# Altium schematic sheet 02_Power.SchDoc: =ProjectTitle
size A3; Organization: Nerdtronix GmbH; Address1: Industriestraße 14a; Address2: D-86438 Kissing; SheetNumber: 2; SheetTotal: 3
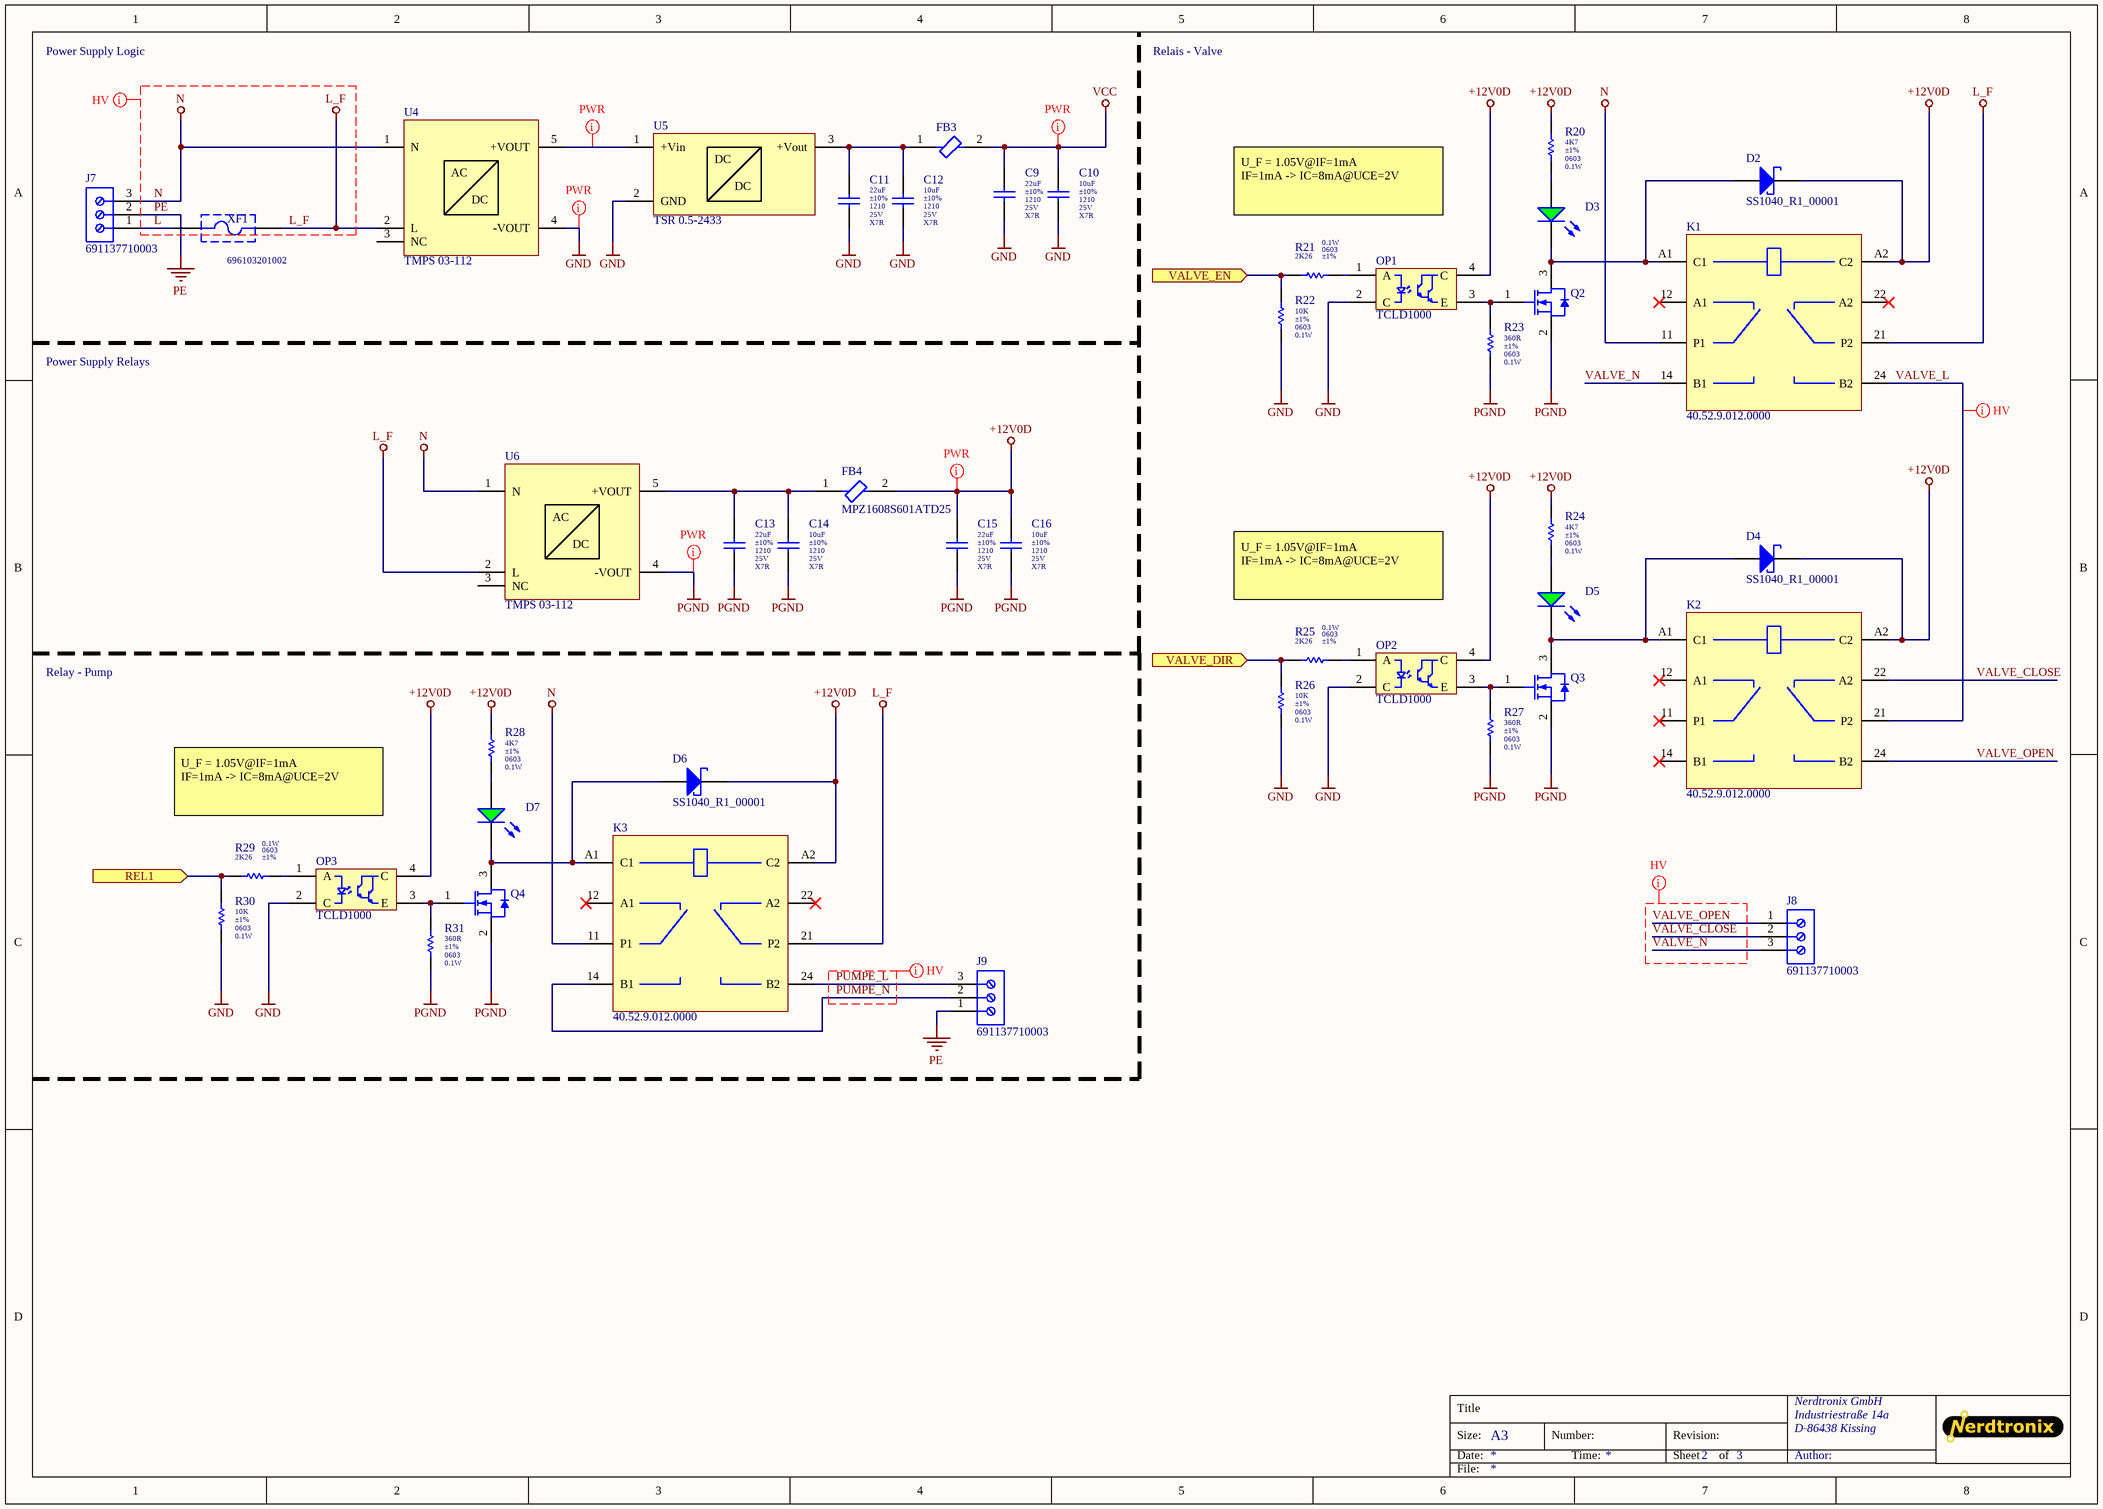
[diagram p0: 02_Power.SchDoc]

## Parts
C9  value 22uF  Tolerance: ±10%  Package: 1210  Voltage: 25V  Dielectric: X7R  [C_1210_B]  (hidden comment: CL32B226KAJNNNE)
C10  value 10uF  Tolerance: ±10%  Package: 1210  Voltage: 25V  Dielectric: X7R  [C_1210_B]  (hidden comment: CL32B106KAJNNNE)
C11  value 22uF  Tolerance: ±10%  Package: 1210  Voltage: 25V  Dielectric: X7R  [C_1210_B]  (hidden comment: CL32B226KAJNNNE)
C12  value 10uF  Tolerance: ±10%  Package: 1210  Voltage: 25V  Dielectric: X7R  [C_1210_B]  (hidden comment: CL32B106KAJNNNE)
C13  value 22uF  Tolerance: ±10%  Package: 1210  Voltage: 25V  Dielectric: X7R  [C_1210_B]  (hidden comment: CL32B226KAJNNNE)
C14  value 10uF  Tolerance: ±10%  Package: 1210  Voltage: 25V  Dielectric: X7R  [C_1210_B]  (hidden comment: CL32B106KAJNNNE)
C15  value 22uF  Tolerance: ±10%  Package: 1210  Voltage: 25V  Dielectric: X7R  [C_1210_B]  (hidden comment: CL32B226KAJNNNE)
C16  value 10uF  Tolerance: ±10%  Package: 1210  Voltage: 25V  Dielectric: X7R  [C_1210_B]  (hidden comment: CL32B106KAJNNNE)
D2  SS1040_R1_00001  [SS1040_R1_00001]
D3  SML-D12P8WT86  [0603 LED]  (value not drawn)
D4  SS1040_R1_00001  [SS1040_R1_00001]
D5  SML-D12P8WT86  [0603 LED]  (value not drawn)
D6  SS1040_R1_00001  [SS1040_R1_00001]
D7  SML-D12P8WT86  [0603 LED]  (value not drawn)
FB3  MPZ1608S601ATD25  [MPZ1608S601ATD25]  (value not drawn)
FB4  MPZ1608S601ATD25  [MPZ1608S601ATD25]
J7  691137710003  [691137710003]
J8  691137710003  [691137710003]
J9  691137710003  [691137710003]
K1  40.52.9.012.0000  [40.52.9.012.0000]
K2  40.52.9.012.0000  [40.52.9.012.0000]
K3  40.52.9.012.0000  [40.52.9.012.0000]
OP1  TCLD1000  [TCLD1000]
OP2  TCLD1000  [TCLD1000]
OP3  TCLD1000  [TCLD1000]
Q2  IRLML6244TRPBF  [IRLML6244TRPBF]  (value not drawn)
Q3  IRLML6244TRPBF  [IRLML6244TRPBF]  (value not drawn)
Q4  IRLML6244TRPBF  [IRLML6244TRPBF]  (value not drawn)
R20  value 4K7  Package: 0603  Power: 0.1W  Tolerance: ±1%  [R_0603_B]  (hidden comment: RC0603FR-074K7L)
R21  value 2K26  Package: 0603  Power: 0.1W  Tolerance: ±1%  [R_0603_B]  (hidden comment: RC0603FR-072K26L)
R22  value 10K  Package: 0603  Power: 0.1W  Tolerance: ±1%  [R_0603_B]  (hidden comment: RC0603FR-0710KL)
R23  value 360R  Package: 0603  Power: 0.1W  Tolerance: ±1%  [R_0603_B]  (hidden comment: RC0603FR-07360RL)
R24  value 4K7  Package: 0603  Power: 0.1W  Tolerance: ±1%  [R_0603_B]  (hidden comment: RC0603FR-074K7L)
R25  value 2K26  Package: 0603  Power: 0.1W  Tolerance: ±1%  [R_0603_B]  (hidden comment: RC0603FR-072K26L)
R26  value 10K  Package: 0603  Power: 0.1W  Tolerance: ±1%  [R_0603_B]  (hidden comment: RC0603FR-0710KL)
R27  value 360R  Package: 0603  Power: 0.1W  Tolerance: ±1%  [R_0603_B]  (hidden comment: RC0603FR-07360RL)
R28  value 4K7  Package: 0603  Power: 0.1W  Tolerance: ±1%  [R_0603_B]  (hidden comment: RC0603FR-074K7L)
R29  value 2K26  Package: 0603  Power: 0.1W  Tolerance: ±1%  [R_0603_B]  (hidden comment: RC0603FR-072K26L)
R30  value 10K  Package: 0603  Power: 0.1W  Tolerance: ±1%  [R_0603_B]  (hidden comment: RC0603FR-0710KL)
R31  value 360R  Package: 0603  Power: 0.1W  Tolerance: ±1%  [R_0603_B]  (hidden comment: RC0603FR-07360RL)
U4  TMPS 03-112  [TMPS 03]
U5  TSR 0.5-2433  [TSR 0.5-2433-Footprint-1]
U6  TMPS 03-112  [TMPS 03]
XF1  696103201002  [696103201002]

## Ports
REL1 (in), VALVE_DIR (in), VALVE_EN (in)

## Nets
+12V0D: C15.2 C16.2 D2.K D4.K D6.K FB4.2 K1.A2(C2) K2.A2(C2) K3.A2(C2) OP1.4(C) OP2.4(C) OP3.4(C) R20.2 R24.2 R28.2
GND: C9.1 C10.1 C11.1 C12.1 OP1.2(C) OP2.2(C) OP3.2(C) R22.1 R26.1 R30.1 U4.4(-VOUT) U5.2(GND)
L_F: K1.21(P2) K3.21(P2) U4.2(L) U6.2(L) XF1.2
N: J7.3 K1.11(P1) K3.11(P1) U4.1(N) U6.1(N)
PE: J7.2 J9.1
PGND: C13.1 C14.1 C15.1 C16.1 Q2.2(S) Q3.2(S) Q4.2(S) R23.1 R27.1 R31.1 U6.4(-VOUT)
VCC: C9.2 C10.2 FB3.2
L: J7.1 XF1.1
PUMPE_L: J9.3 K3.24(B2)
PUMPE_N: J9.2 K3.14(B1)
REL1: R29.2 R30.2 ; port REL1
VALVE_CLOSE: J8.2 K2.22(A2)
VALVE_DIR: R25.2 R26.2 ; port VALVE_DIR
VALVE_EN: R21.2 R22.2 ; port VALVE_EN
VALVE_L: K1.24(B2) K2.21(P2)
VALVE_N: J8.3 K1.14(B1)
VALVE_OPEN: J8.1 K2.24(B2)
NetC11_2: C11.2 C12.2 FB3.1 U5.3(+Vout)
NetC13_2: C13.2 C14.2 FB4.1 U6.5(+VOUT)
NetD2_A: D2.A D3.K K1.A1(C1) Q2.3(D)
NetD3_A: D3.A R20.1
NetD4_A: D4.A D5.K K2.A1(C1) Q3.3(D)
NetD5_A: D5.A R24.1
NetD6_A: D6.A D7.K K3.A1(C1) Q4.3(D)
NetD7_A: D7.A R28.1
NetOP1_1: OP1.1(A) R21.1
NetOP1_3: OP1.3(E) Q2.1(G) R23.2
NetOP2_1: OP2.1(A) R25.1
NetOP2_3: OP2.3(E) Q3.1(G) R27.2
NetOP3_1: OP3.1(A) R29.1
NetOP3_3: OP3.3(E) Q4.1(G) R31.2
NetU4_5: U4.5(+VOUT) U5.1(+Vin)

Not connected (* = marked no-connect by the designer): K1 12(A1)* 22(A2)*; K2 11(P1)* 12(A1)* 14(B1)*; K3 12(A1)* 22(A2)*; U4 3(NC); U6 3(NC)

## Layout directives
net class HV: L, L_F, N, PE, PUMPE_L, PUMPE_N, VALVE_CLOSE, VALVE_L, VALVE_N, VALVE_OPEN
net class PWR: +12V0D, GND, NetU4_5, PGND, VCC

## Notes on the sheet
- Power Supply Logic
- Relais - Valve
- U_F = 1.05V@IF=1mA
  IF=1mA -> IC=8mA@UCE=2V
- Power Supply Relays
- Relay - Pump
- Title
- Size:
- Date:
- A3
- Number:
- Time:
- Revision:
- Sheet
- of
- Author:
- File:
- (in symbol CMP-002-000000-10) AC; DC
- (in symbol CMP-002-000808-6) DC

## Library data of the parts
C9 C11 C13 C15 = CMP-002-001930-51: CAP 22uF 25V 1210 ±10% X7R; Manufacturer: Samsung; Pad Count: 2; Maximum Operating Temperature: 125; Packaging: cut tape; Distributor: Digikey; Minimum Operating Temperature: -55; Distributor Ordering Code: 1276-3392-1-ND; Creator: MSt 31-08-21; RoHS: Yes; Manufacturer Part Number: CL32B226KAJNNNE; Mounting Type: SMT
C10 C12 C14 C16 = CMP-002-001929-51: CAP 10uF 25V 1210 ±10% X7R; Manufacturer: Samsung; Pad Count: 2; Creator: MSt 31-08-21; Mounting Type: SMT; Manufacturer Part Number: CL32B106KAJNNNE; Maximum Operating Temperature: 125; Distributor Ordering Code: 1276-1807-1-ND; RoHS: Yes; Packaging: cut tape; Distributor: Digikey; Minimum Operating Temperature: -55
D2 D4 D6 = CMP-004-00002-7: Schottky Diode, 0.55V UF@IF=1A, 1A IF_max, SOD-123; Manufacturer: Panjit International; Pad Count: 2; UF: 0.55V; Packaging: Cut Tape; RoHS: yes; Mounting Type: SMT; Distributor: Digikey; Distributor Ordering Code: 3757-SS1040_R1_00001CT-ND; Manufacturer Part Number: SS1040_R1_00001; Design Item ID: SS1040_R1_00001; Maximum Operating Temperature: 125; Minimum Operating Temperature: -55; Creator: MSt 06-02-22; IF: 1A
D3 D5 D7 = CMP-004-00001-11: Green LED 0603; Manufacturer: Rohm Semiconductor; Pad Count: 2; Mounting Type: SMT; Maximum Operating Temperature: 85; Distributor Ordering Code: 511-1579-1-ND; Minimum Operating Temperature: -40; RoHS: Yes; Packaging: Cut Tape; Manufacturer Part Number: SML-D12P8WT86; Creator: MSt 31-01-22; Distributor: Digikey
FB3 FB4 = CMP-00011-4: SMD Ferrit Bead 600Ω@100MHz 1A DCR 150mΩ; Manufacturer: TDK; Z@100MHz: 600Ω; Pad Count: 2; Distributor: Digikey; Mounting Type: SMT; RoHS: Yes; Minimum Operating Temperature: -55; Design Item ID: MPZ1608S601ATD25; Distributor Ordering Code: 445-MPZ1608S601ATD25CT-ND; Packaging: Cut Tape; Maximum Operating Temperature: 125; Manufacturer Part Number: MPZ1608S601ATD25; Creator: MSt 03-08-23
J7-J9 = CMP-003-000003-7: WR-TBL Serie 1377 Horizontal Entry, Pressure Clamp, THT, Pitch 5mm, 3p; Manufacturer: Wuerth Elektronik; Pad Count: 3; Mounting Type: THT; Packaging: Bag; Minimum Operating Temperature: -30; Creator: MSt 08-12-21; Distributor Ordering Code: 732-10956-ND; Distributor: Digikey; Manufacturer Part Number: 691137710003; RoHS: Yes; Maximum Operating Temperature: 110
K1-K3 = CMP-002-000814-7: Relay Double Pole, 12V Coil Voltage, 8.0 A Continous Switched Current; Manufacturer: Finder Relays; coil_resistance: 220Ohm; coil_voltage_min: 8.8V; coil_voltage_max: 18.0V; Pad Count: 8; coil_current: 55mA; Distributor Ordering Code: 2066-40.52.9.012.0000-ND; Distributor: Digikey; Mounting Type: THT; Maximum Operating Temperature: 85; Minimum Operating Temperature: -40; Packaging: Bag; Manufacturer Part Number: 40.52.9.012.0000; RoHS: Yes; Creator: MSt 08-12-21
OP1-OP3 = CMP-006-000012-4: Optocoupler, Photodarlington Output; Manufacturer: Vishay; Pad Count: 4; Distributor: Digikey; Mounting Type: SMT; RoHS: Yes; Design Item ID: TCLD1000; Creator: MSt 23-08-22; Manufacturer Part Number: TCLD1000; Distributor Ordering Code: TCLD1000CT-ND; Packaging: Cut Tape; Minimum Operating Temperature: -55; Maximum Operating Temperature: 100
Q2-Q4 = CMP-013-00002-6: N-MOSFET Vds 20V Uth 1.1V ID 5.1A RDSon 27mΩ; Manufacturer: Infineon Technologies; Pad Count: 3; Distributor: Digikey; Distributor Ordering Code: IRLML6244TRPBFCT-ND; Manufacturer Part Number: IRLML6244TRPBF; Mounting Type: SMT; RoHS: Yes; Creator: MSt 10-10-22; Maximum Operating Temperature: 150; Packaging: Cut Tape; Minimum Operating Temperature: -55; Design Item ID: IRLML6244TRPBF
R20 R24 R28 = CMP-002-000329-18: RES 4K7 0603 1% 0.1W; Manufacturer: Yageo; Pad Count: 2; Maximum Voltage: 150V; Creator: MSt 12-11-21; Distributor Ordering Code: 311-4.70KHRCT-ND; Mounting Type: SMT; Packaging: Cut Tape; Minimum Operating Temperature: -55; Maximum Operating Temperature: 155; Distributor: Digikey; Manufacturer Part Number: RC0603FR-074K7L; RoHS: Yes
R21 R25 R29 = CMP-002-004839-43: RES 2K26 0603 1% 0.1W; Manufacturer: Yageo; Maximum Voltage: 150V; Pad Count: 2; RoHS: Yes; Maximum Operating Temperature: 155; Creator: MSt 26-08-21; Mounting Type: SMT; Distributor: Digikey; Distributor Ordering Code: 311-2.26KHRCT-ND; Packaging: Cut Tape; Minimum Operating Temperature: -55; Manufacturer Part Number: RC0603FR-072K26L
R22 R26 R30 = CMP-002-004901-43: RES 10K 0603 1% 0.1W; Manufacturer: Yageo; Maximum Voltage: 150V; Pad Count: 2; Creator: MSt 26-08-21; Maximum Operating Temperature: 155; Mounting Type: SMT; Manufacturer Part Number: RC0603FR-0710KL; Packaging: Cut Tape; RoHS: Yes; Distributor: Digikey; Distributor Ordering Code: 311-10.0KHRCT-ND; Minimum Operating Temperature: -55
R23 R27 R31 = CMP-002-000308-18: RES 360R 0603 1% 0.1W; Manufacturer: Yageo; Pad Count: 2; Maximum Voltage: 150V; Maximum Operating Temperature: 155; Packaging: Cut Tape; Distributor Ordering Code: 311-360HRCT-ND; Manufacturer Part Number: RC0603FR-07360RL; Mounting Type: SMT; Minimum Operating Temperature: -55; Distributor: Digikey; RoHS: Yes; Creator: MSt 12-11-21
U4 U6 = CMP-002-000000-10: Traco 3W AC/DC converter 12V Output; Manufacturer: Traco Power; Pad Count: 5; Creator: MSt 05-10-21; Maximum Operating Temperature: 70; Manufacturer Part Number: TMPS 03-112; Mounting Type: THT; Minimum Operating Temperature: -25; RoHS: yes; Packaging: box; Distributor Ordering Code: 1951-1176-ND; Distributor: Digikey
U5 = CMP-002-000808-6: Traco 0.5A DC/DC Converter 3.3V Output; Pad Count: 3; Packaging: Bulk; RoHS: Yes; Manufacturer Part Number: TSR 0.5-2433; Creator: MSt 15-11-21; Minimum Operating Temperature: -40; Manufacturer: Traco; Distributor: Digikey; Maximum Operating Temperature: 90; Distributor Ordering Code: 1951-2707-ND; Mounting Type: THT
XF1 = CMP-003-000004-8: WR-FSH Fuseholder THR Blocks PCB Clip Cover; Manufacturer: Wuerth Elektronik; Pad Count: 2; Distributor: Digikey; Minimum Operating Temperature: -30; Maximum Operating Temperature: 120; Distributor Ordering Code: 732-11372-ND; Creator: MSt 08-12-21; Manufacturer Part Number: 696103201002; Mounting Type: THT; RoHS: Yes; Packaging: Box; Design Item ID: 696103201002; Trip Current: -